# Altium schematic sheet HalfBridge.SchDoc
size A4
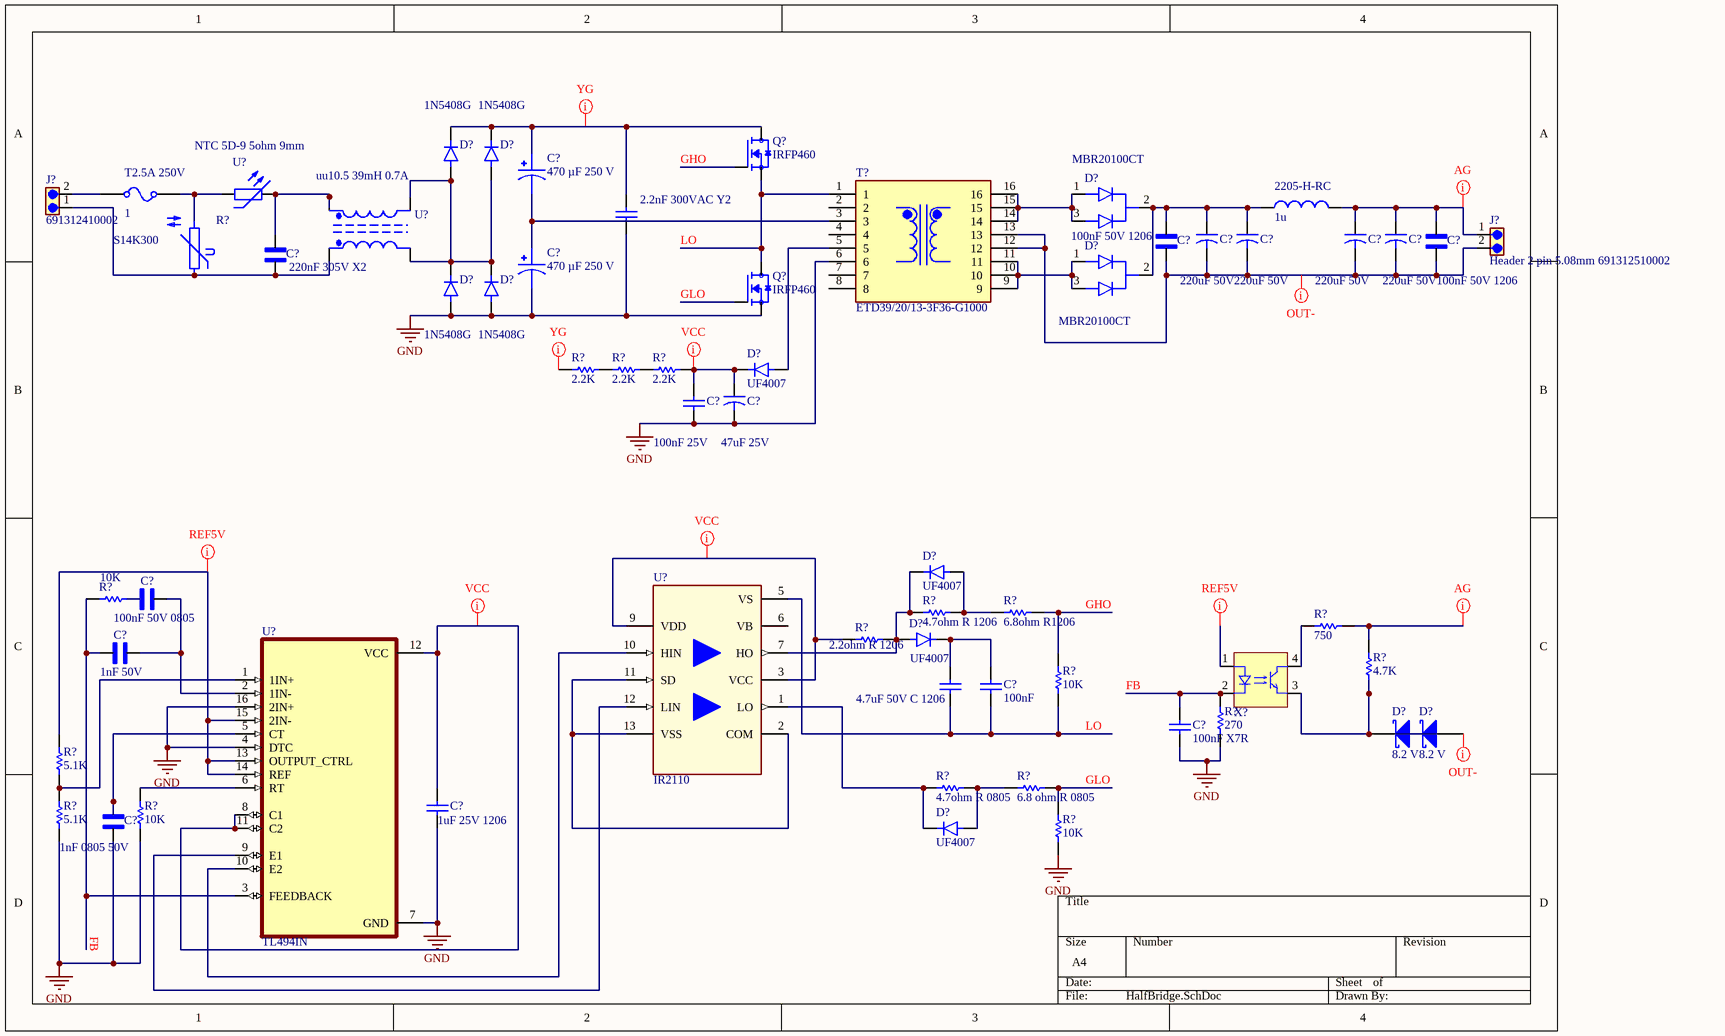
[diagram p0: HalfBridge.SchDoc]

## Parts
(Parts that share a designator on the sheet are numbered #1, #2 ... from top to bottom, then left to right.)
2205-H-RC  value 1u  (hidden comment: 2205-H-RC)
?#1  2.2nF 300VAC Y2
?#2  4.7uF 50V C 1206  [1206]
C?#1  470 µF 250 V  [C470uF 250V AP_B43547F2477M080]
C?#2  220uF 50V  [22uF 400V]
C?#3  220uF 50V  [22uF 400V]
C?#4  220uF 50V  [22uF 400V]
C?#5  220uF 50V  [22uF 400V]
C?#6  100nF 50V 1206  [CAPRR1000W60L1300T400H900]
C?#7  100nF 50V 1206  [CAPRR1000W60L1300T400H900]
C?#8  220nF 305V X2  [CAPRR1000W60L1300T400H900]
C?#9  470 µF 250 V  [C470uF 250V AP_B43547F2477M080]
C?#10  47uF 25V  [CAPPRD200W50D525H1250]
C?#11  100nF 25V  [1206]
C?#12  100nF 50V 0805  [CAPC2012X145N]
C?#13  1nF 50V  [CAPC2012X145N]
C?#14  100nF  [RCE7U2J333J5B1H03B]
C?#15  100nF X7R  [RCE7U2J333J5B1H03B]
C?#16  1nF 0805 50V  [CAPC2012X145N]
C?#17  1uF 25V 1206  [1206]
D?#1  1N5408G  [DIOAD1990W125L900D530]
D?#2  1N5408G  [DIOAD1990W125L900D530]
D?#3  MBR20100CT  [TO254P1066X482X2286-3]
D?#4  MBR20100CT  [TO254P1066X482X2286-3]
D?#5  1N5408G  [DIOAD1990W125L900D530]
D?#6  1N5408G  [DIOAD1990W125L900D530]
D?#7  UF4007  [DIOAD1036W78L470D235]
D?#8  UF4007  [DIOAD1036W78L470D235]
D?#9  UF4007  [DIOAD1036W78L470D235]
D?#10  8.2 V  [SOD-123]
D?#11  8.2 V  [SOD-123]
D?#12  UF4007  [DIOAD1036W78L470D235]
J?#1  691312410002  [Header 2 pin 7.62mm 691312410002]
J?#2  Header 2 pin 5.08mm 691312510002  [Header 2 pin 5.08mm]
Q?#1  IRFP460  [TO546P1587X531X2511-3]
Q?#2  IRFP460  [TO546P1587X531X2511-3]
R?#1  S14K300  [S14K300]
R?#2  value 2.2K  (hidden comment: 2.2k ohm 5W)
R?#3  value 2.2K  (hidden comment: 2.2k ohm 5W)
R?#4  value 2.2K  (hidden comment: 2.2k ohm 5W)
R?#5  value 10K  (hidden comment: Resistor)
R?#6  4.7ohm R 1206  [R 1206]
R?#7  6.8ohm R1206  [R 1206]
R?#8  2.2ohm R 1206  [R 1206]
R?#9  value 750  (hidden comment: 750 Ohm 1/4 W)
R?#10  value 4.7K  (hidden comment: 4.7k ohm 1/4 W)
R?#11  value 10K  (hidden comment: Resistor)
R?#12  value 270  (hidden comment: Resistor)
R?#13  4.7ohm R 0805  [R 1206]
R?#14  6.8 ohm R 0805  [R 1206]
R?#15  value 5.1K  (hidden comment: Resistor)
R?#16  value 10K  (hidden comment: Resistor)
R?#17  value 5.1K  (hidden comment: Resistor)
R?#18  value 10K  (hidden comment: Resistor)
T2.5A_250V  CURRENT: 1  (hidden comment: Fuse TR5 T2.5)
T?  ETD39/20/13-3F36-G1000  [XFMR_ETD39/20/13-3F36-G1000]
U?#1  NTC 5D-9 5ohm 9mm  [NTC B57153S0100]
U?#2  uu10.5 39mH 0.7A  [EMC SMPS TDK]
U?#3  IR2110
U?#4  TL494IN  [DIP794W45P254L1969H508Q16]
X?  PC81710NIP1B  [PC817 SMD]  (value not drawn)

## Nets
GND: ?#1.1 C?#9.2 C?#10.2 C?#11.1 C?#15.1 C?#16.1 C?#17.1 D?#5.A D?#6.A Q?#2.3(S) R?#12.1 R?#16.2 R?#17.1 R?#18.1 T?.6 U?#4.4(DTC) U?#4.7(GND) U?#4.16(2IN+)
Net2205-H-RC_1: 2205-H-RC.1 C?#2.1 C?#3.1 C?#6.2 D?#3.2(COMMON_CATHODE) D?#4.2(COMMON_CATHODE)
Net2205-H-RC_2: 2205-H-RC.2 C?#4.1 C?#5.1 C?#7.2 J?#2.1
Net?#1_2: ?#1.2 C?#1.1 D?#1.C(K) D?#2.C(K) Q?#1.2(D)
Net?#2_1: ?#2.1 C?#14.1 R?#11.1 U?#3.5(VS)
Net?#2_2: ?#2.2 C?#14.2 D?#9.C(K)
NetC?#1_2: C?#1.2 C?#9.1 T?.3
NetC?#2_2: C?#2.2 C?#3.2 C?#4.2 C?#5.2 C?#6.1 C?#7.1 J?#2.2 T?.12 T?.13
NetC?#8_1: C?#8.1 J?#1.1 R?#1.1 U?#2.1
NetC?#8_2: C?#8.2 U?#1.2 U?#2.2
NetC?#10_1: C?#10.1 C?#11.2 D?#7.C(K) R?#4.2
NetC?#12_1: C?#12.1 C?#13.2 U?#4.2(1IN-)
NetC?#12_2: C?#12.2 R?#5.2
NetC?#13_1: C?#13.1 R?#5.1 U?#4.3(FEEDBACK)
NetC?#15_2: C?#15.2 R?#12.2 X?.2(K)
NetC?#16_2: C?#16.2 U?#4.5(CT)
NetC?#17_2: C?#17.2 U?#4.8(C1) U?#4.11(C2) U?#4.12(VCC)
NetD?#1_A: D?#1.A D?#2.A D?#5.C(K) D?#6.C(K) U?#2.3 U?#2.4
NetD?#3_1: D?#3.1(ANODE1) D?#3.3(ANODE2) T?.14 T?.15 T?.16
NetD?#4_1: D?#4.1(ANODE1) D?#4.3(ANODE2) T?.9 T?.10 T?.11
NetD?#7_A: D?#7.A T?.5
NetD?#8_A: D?#8.A R?#6.2 R?#7.1
NetD?#8_C: D?#8.C(K) D?#9.A R?#6.1 R?#8.2 U?#3.7(HO)
NetD?#10_1: D?#10.1(A) D?#11.2(K)
NetD?#10_2: D?#10.2(K) R?#10.1 X?.3(E)
NetD?#12_A: D?#12.A R?#13.2 R?#14.1
NetD?#12_C: D?#12.C(K) R?#13.1 U?#3.1(LO)
NetJ?#1_2: J?#1.2 T2.5A_250V.1
NetQ?#1_3: Q?#1.3(S) Q?#2.2(D) T?.1
NetR?#1_2: R?#1.2 T2.5A_250V.2 U?#1.1
NetR?#7_2: R?#7.2 R?#11.2
NetR?#8_1: R?#8.1 U?#3.3(VCC) U?#3.9(VDD)
NetR?#9_1: R?#9.1 X?.4(C)
NetR?#9_2: R?#9.2 R?#10.2
NetR?#14_2: R?#14.2 R?#18.2
NetR?#15_1: R?#15.1 R?#17.2 U?#4.1(1IN+)
NetR?#15_2: R?#15.2 U?#4.13(OUTPUT_CTRL) U?#4.14(REF) U?#4.15(2IN-)
NetR?#16_1: R?#16.1 U?#4.6(RT)
NetU?#3_2: U?#3.2(COM) U?#3.11(SD) U?#3.13(VSS)
NetU?#3_10: U?#3.10(HIN) U?#4.10(E2)
NetU?#3_12: U?#3.12(LIN) U?#4.9(E1)

Not connected (* = marked no-connect by the designer): D?#11 1(A); Q?#1 1(G); Q?#2 1(G); R?#2 1 2; R?#3 1 2; R?#4 1; T? 2 4 7 8; U?#3 6(VB); X? 1(A)

## Layout directives
mark named YG: Net?#1_2, NetR?#2_1
mark named VCC: NetC?#10_1, NetC?#17_2, NetR?#8_1
mark named REF5V: NetR?#15_2, NetX?_1
mark named AG: Net2205-H-RC_2, NetR?#9_2
mark named OUT-: NetC?#2_2, NetD?#11_1

## Notes on the sheet
- (near Q?#1) GHO
- LO
- GLO
- GHO
- FB
- (near R?#18) GLO
- (near R?#11) LO

## Library data of the parts
2205-H-RC = Inductor: 22uF 10.3A 2205-H-RC-Bourns; SimulationGenericComponent: True
?#1 = Capacitor: 2.2nF 300VAC Y2 DE6E3KJ222MN3A; SimulationGenericComponent: True; Value: 2.2nF
?#2 = C 1206: SMD 1206 SMD MLCC 1206 X7R 50V 4.7UF | AVX 12065C475KAT2A; Deger: *
C?#1 C?#9 = 470 µF 250 V B43547F2477M080: 470 µF 250 V B43547F2477M080 Aluminum Electrolytic Capacitors Radial, Can - Snap-In 150mOhm @ 100Hz 3000 Hrs @ 105Â°C; MF: TDK; SnapEDA_Link: https://www.snapeda.com/parts/B43547F2477M080/TDK/view-part/?ref=snap; Package: None; Value: *; MP: B43547F2477M080; Check_prices: https://www.snapeda.com/parts/B43547F2477M080/TDK/view-part/?ref=eda
C?#2-C?#5 = C 220uF 50V Panasonic: Manufacturer_Name: AVX; Manufacturer_Part_Number: TPSE107K020R0150; Allied_Number: 70002020; Datasheet Link: http://datasheets.avx.com/TPS.pdf; Height: 4.3mm; Mouser Part Number: 581-TPSE107K020R0150; Mouser Price/Stock: https://www.mouser.com/Search/Refine.aspx?Keyword=581-TPSE107K020R0150; RS Part Number: 1359911P; RS Price/Stock: http://uk.rs-online.com/web/p/products/1359911P; Allied Price/Stock: http://www.alliedelec.com/avx-tpse107k020r0150/70002020/
C?#6 C?#7 = 100nF 50V 1206: MF: {'manufacturer': u'EPCOS - TDK Electronics'}; MP: B32021A3222M189; Package: None; Price: None; Value: *; Availability: Unavailable
C?#8 = 220nF 305V X2B32021A3222M189: B32021A3222M189 Cap Film Suppression Y2 0.0022uF 1500VDC/300VAC PP 20% (13 X 4 X 9mm) Radial Plastic Rectangular Can 10mm 110°C Automotive T/R; MF: {'manufacturer': u'EPCOS - TDK Electronics'}; Package: None; Price: None; Value: *; MP: B32021A3222M189; Availability: Unavailable
C?#10 = C 47uF 25V 250mArms 400mOhm: 1189-1590-1-ND; ComponentLink1Description: http://www.rubycon.co.jp/en/catalog/e_pdfs/aluminum/e_px.pdf
C?#11 = C 1206: SMD 1206 100nF 25V; Deger: *
C?#12 = 100nF 50V 0805: WCAP-CSGP General Purpose MLCC; SMT 0805; X7R; 100nF 10%; 50V; -55C to +125C; Tech. PN X7R0805104K050DFCT10000; MF: Vishay Vitramon; MP: VJ0805A102JXAMC; SnapEDA_Link: https://www.snapeda.com/parts/VJ0805A102JXAMC/Vishay/view-part/?ref=snap; Package: 2012 Vishay Vitramon; Value: *; Check_prices: https://www.snapeda.com/parts/VJ0805A102JXAMC/Vishay/view-part/?ref=eda
C?#13 C?#16 = VJ0805A102JXAMC: 0805 1nF 50 V Â±5 % Tolerance C0G/NP0 SMT Multilayer Ceramic Chip Capacitor; MF: Vishay Vitramon; SnapEDA_Link: https://www.snapeda.com/parts/VJ0805A102JXAMC/Vishay/view-part/?ref=snap; Package: 2012 Vishay Vitramon; Value: *; MP: VJ0805A102JXAMC; Check_prices: https://www.snapeda.com/parts/VJ0805A102JXAMC/Vishay/view-part/?ref=eda
C?#14 = 100nF X7R 5mm: 490-8944-ND RDER73A104K5B1H03B 1kV X7R; Published: 8-Jun-2000; LatestRevisionDate: 17-Jul-2002; LatestRevisionNote: Re-released for DXP Platform.; PackageReference: RAD-0.3; Publisher: Altium Limited; PackageDescription: Radial Cap, Thru-Hole; 2 Leads; 0.3 in Pin Spacing
C?#15 = 100nF X7R 5mm: 490-8944-ND 1kV  X7R RDER73A104K5B1H03B; Published: 8-Jun-2000; LatestRevisionDate: 17-Jul-2002; LatestRevisionNote: Re-released for DXP Platform.; PackageReference: RAD-0.3; Publisher: Altium Limited; PackageDescription: Radial Cap, Thru-Hole; 2 Leads; 0.3 in Pin Spacing
C?#17 = C 1206: SMD 1206 1uF 25V; Deger: *
D?#1 D?#2 D?#5 D?#6 = 1N5408G: 3A, 1000V, Standard Rectifier; MF: Taiwan Semiconductor; SnapEDA_Link: https://www.snapeda.com/parts/1N5408G/taiwan/view-part/?ref=snap; Package: DO-201AD Taiwan Semiconductor; Value: *; MP: 1N5408G; Check_prices: https://www.snapeda.com/parts/1N5408G/taiwan/view-part/?ref=eda
D?#3 D?#4 = MBR20100CT: 20A, 100V, Planar Schottky; MF: Taiwan Semiconductor; SnapEDA_Link: https://www.snapeda.com/parts/MBR20100CT/taiwan/view-part/?ref=snap; Package: TO-220AB-3 Taiwan Semiconductor; Value: *; MP: MBR20100CT; Check_prices: https://www.snapeda.com/parts/MBR20100CT/taiwan/view-part/?ref=eda
D?#7-D?#9 D?#12 = UF4007: UF4007 Series 1 A 1000 V 75 ns Through Hole Fast Rectifier - DO-41; MF: Fairchild Semiconductor; MP: UF4007.; SnapEDA_Link: https://www.snapeda.com/parts/UF4007./Onsemi/view-part/?ref=snap; Package: DO-41 Fairchild Semiconductor; Value: *; Check_prices: https://www.snapeda.com/parts/UF4007./Onsemi/view-part/?ref=eda
D?#10 D?#11 = Zener SOD-123: SOD-123 Zener 8.2V; Note: Pin 2 is not connected and not drawn.; Published: 21-Mar-2003; LatestRevisionDate: 29-May-2009; LatestRevisionNote: IPC-7351 Footprint Added.; DatasheetVersion: Oct-1999; PackageVersion: Sep-2001; PackageReference: SOT-23; Publisher: Altium Limited; PackageDescription: 3-Pin SOT-23 Package 0.95 mm Pitch, 2.5 mm Lead Span; ComponentLink1Description: Manufacturer Link; ComponentLink1URL: http://www.infineon.com/; ComponentLink2Description: Datasheet; ComponentLink2URL: http://www.infineon.com/upload/Document/cmc_upload/documents/009/363/bat17series.pdf
J?#1 = 691312410002: 7.62mm Pitch Straight Pluggable Term Block, PCB Header, Through Hole, 2 Way ¦ Wurth Electronics 691312410002; MF: WÃ¼rth Elektronik; SnapEDA_Link: https://www.snapeda.com/parts/691312410002/W%25C3%25BCrth+Elektronik+Midcom/view-part/?ref=snap; Package: None; Value: *; MP: 691312410002; Check_prices: https://www.snapeda.com/parts/691312410002/W%25C3%25BCrth+Elektronik+Midcom/view-part/?ref=eda
J?#2 = Header 2 pin 5.08mm 691312510002: MF: {'manufacturer': u'W\xfcrth Elektronik'}; Package: None; Price: None; Value: *; MP: 691312510002; Availability: Unavailable
Q?#1 Q?#2 = IRFP460: N-Channel 500 V 20A (Tc) 280W (Tc) Through Hole TO-247AC; MF: Vishay Siliconix; SnapEDA_Link: https://www.snapeda.com/parts/IRFP460/Vishay+Siliconix/view-part/?ref=snap; Package: TO-247 Vishay Siliconix; MP: IRFP460; Check_prices: https://www.snapeda.com/parts/IRFP460/Vishay+Siliconix/view-part/?ref=eda; Purchase-URL: https://pricing.snapeda.com/search/part/IRFP460/?ref=eda; Price: None; Value: *; Availability: In Stock
R?#1 = S14K300: Varistors 300VAC 125J 775V-CLAMP 6KA-PK; MF: EPCOS / TDK; Package: None; Value: *; Availability: Not in stock; Check_prices: https://www.snapeda.com/parts/S14K300/EPCOS+%2528TDK%2529/view-part/?ref=eda; MP: S14K300; Price: None; SnapEDA_Link: https://www.snapeda.com/parts/S14K300/EPCOS+%2528TDK%2529/view-part/?ref=snap
R?#2-R?#4 = Resistor: RESISTOR 5 WATT CERMET WIREWOUND FLAMEPROOF 2.2K OHM 5% AXIAL LEAD | NTE Electronics Inc. 5W222; TC1: 0; SimulationGenericComponent: True; TC2: 0
R?#5 R?#16 = Resistor: Resistor 1206 SMD; TC1: 0; SimulationGenericComponent: True; TC2: 0
R?#6 = R 1206: 4.7 ohm SMD 1206; Deger: *
R?#7 = R 1206: SMD 1206 6.8ohm; Deger: *
R?#8 = R 1206: SMD 1206; Deger: *
R?#9 = Resistor: 750 ohm smd1260; TC1: 0; SimulationGenericComponent: True; TC2: 0
R?#10 = Resistor: 4.7k ohm smd 1260; TC1: 0; SimulationGenericComponent: True; TC2: 0
R?#11 R?#18 = Resistor: Resistor 1/4W Karbon; TC1: 0; SimulationGenericComponent: True; TC2: 0
R?#12 = Resistor: 270 ohm smd 1260; TC1: 0; SimulationGenericComponent: True; TC2: 0
R?#13 = R 1206: 4.7 ohm SMD 0805; Deger: *
R?#14 = R 1206: 6.8 ohm SMD 0805; Deger: *
R?#15 R?#17 = Resistor: TC1: 0; SimulationGenericComponent: True; TC2: 0
T2.5A_250V = Fuse: RESISTANCE: 1m; SimulationGenericComponent: True
T? = ETD39/20/13-3F36-G1000: Uncoated 3F36 Ferrite Core ETD Type 1.575 (40.00mm) Length 0.504 (12.80mm) Width Diameter 0.780 (19.80mm) Height; MF: Ferroxcube; SnapEDA_Link: https://www.snapeda.com/parts/ETD39/20/13-3F36-G1000/Ferroxcube/view-part/?ref=snap; Package: Ferroxcube; Value: *; MP: ETD39/20/13-3F36-G1000; Check_prices: https://www.snapeda.com/parts/ETD39/20/13-3F36-G1000/Ferroxcube/view-part/?ref=eda
U?#1 = NTC 5D-9 5ohm 9mm: 5D-9; Published: 8-Jun-2000; LatestRevisionDate: 17-Jul-2002; LatestRevisionNote: Re-released for DXP Platform.; PackageReference: AXIAL-0.4; Publisher: Altium Limited; PackageDescription: Axial Device, Thru-Hole; 2 Leads; 0.4 in Pin Spacing
U?#2 = UU10.5 30mH: UU10.5 30mH 0.35mm 2A
U?#3 = IR2110: High and Low Side Driver; Manufacturer: Infineon Technologies; Manufacturer Order Number: IR2110; PackageReference: PG-DIP-14-903
U?#4 = TL494IN: 40V, 0.2A 300KHz PWM controller; MF: Texas Instruments; SnapEDA_Link: https://www.snapeda.com/parts/TL494IN/Texas+Instruments/view-part/?ref=snap; Package: PDIP-16 Texas Instruments; Value: *; MP: TL494IN; Check_prices: https://www.snapeda.com/parts/TL494IN/Texas+Instruments/view-part/?ref=eda
X? = PC817: 1855-1014-1-ND